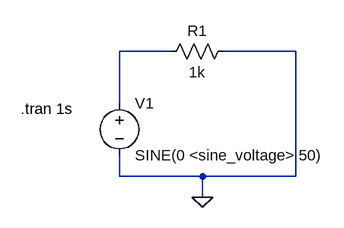
[diagram p0: schematic AC_R_circuit.asc]
AC_R_circuit.asc, the LTspice schematic file:
Version 4
SHEET 1 880 680
WIRE 176 0 96 0
WIRE 368 0 256 0
WIRE 96 80 96 0
WIRE 96 192 96 160
WIRE 224 192 96 192
WIRE 368 192 368 0
WIRE 368 192 224 192
WIRE 224 224 224 192
FLAG 224 224 0
SYMBOL voltage 96 64 R0
WINDOW 123 0 0 Left 0
WINDOW 39 0 0 Left 0
SYMATTR InstName V1
SYMATTR Value SINE(0 <sine_voltage> 50)
SYMBOL res 272 -16 R90
WINDOW 0 0 56 VBottom 2
WINDOW 3 32 56 VTop 2
SYMATTR InstName R1
SYMATTR Value 1k
TEXT -56 88 Left 2 !.tran 1s

The netlist it stands for:
* AC_R_circuit.asc
V1 N001 0 SINE(0 <sine_voltage> 50)
R1 0 N001 1k
.tran 1s
.backanno
.end